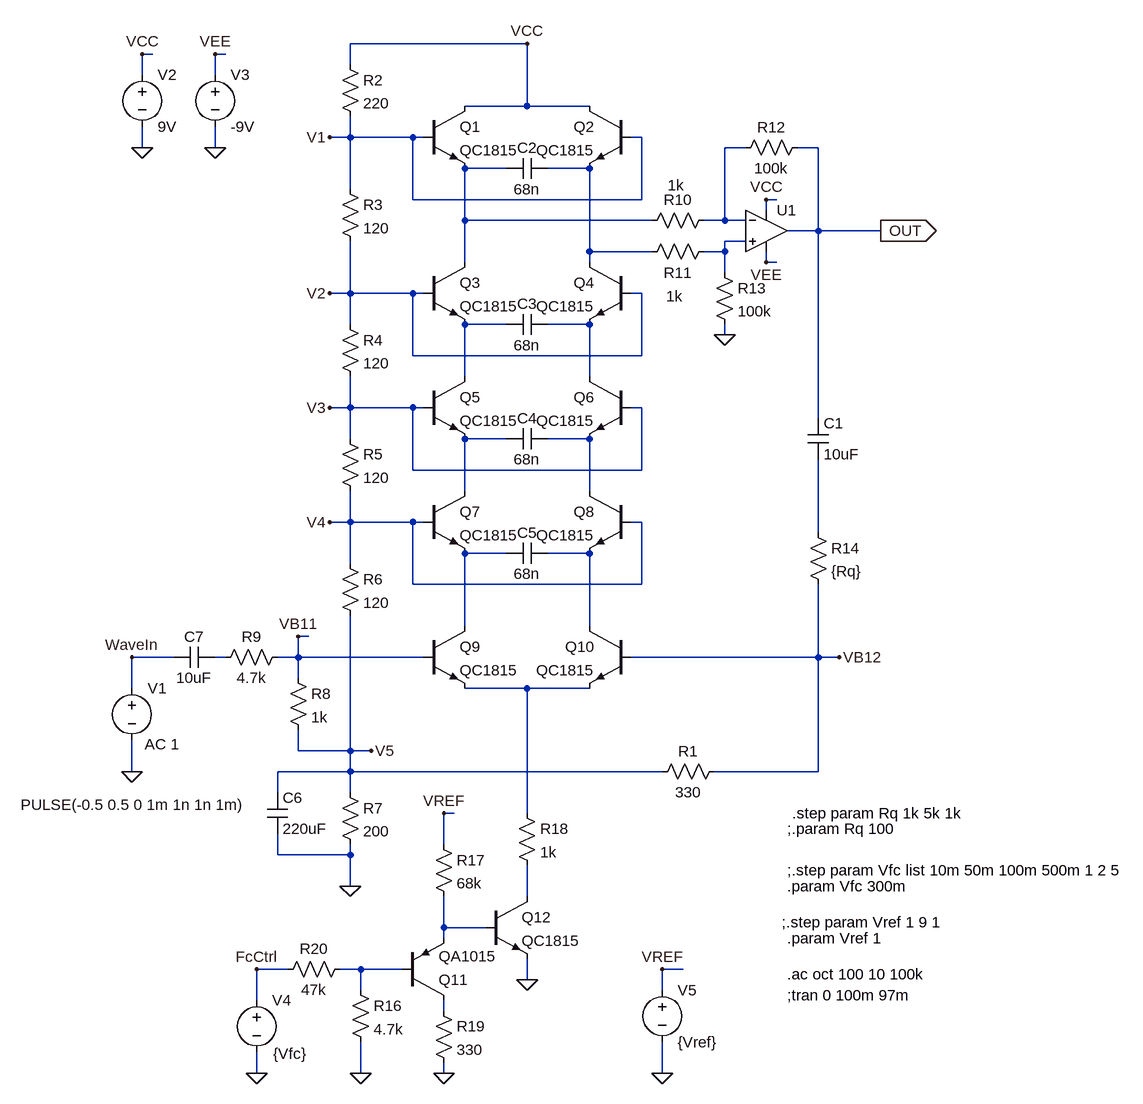
[diagram p0: schematic Analog2_0_Ladder_DiffAmp_CS_AntiLog_R9V_qctrl.asc]
Analog2_0_Ladder_DiffAmp_CS_AntiLog_R9V_qctrl.asc, the LTspice schematic file:
Version 4
SHEET 1 1344 1976
WIRE 240 -32 -32 -32
WIRE -336 -16 -352 -16
WIRE -224 -16 -240 -16
WIRE -32 0 -32 -32
WIRE -352 16 -352 -16
WIRE -240 16 -240 -16
WIRE 240 64 240 -32
WIRE 240 64 144 64
WIRE 336 64 240 64
WIRE -32 112 -32 80
WIRE -32 112 -64 112
WIRE 64 112 -32 112
WIRE 80 112 64 112
WIRE 416 112 400 112
WIRE -352 128 -352 96
WIRE -240 128 -240 96
WIRE 576 128 544 128
WIRE 688 128 656 128
WIRE 208 160 144 160
WIRE 336 160 272 160
WIRE -32 192 -32 112
WIRE 64 208 64 112
WIRE 416 208 416 112
WIRE 416 208 64 208
WIRE 624 208 608 208
WIRE 608 224 608 208
WIRE 144 240 144 160
WIRE 432 240 144 240
WIRE 544 240 544 128
WIRE 544 240 512 240
WIRE 576 240 544 240
WIRE 688 256 688 128
WIRE 688 256 640 256
WIRE 784 256 688 256
WIRE 576 272 544 272
WIRE 336 288 336 160
WIRE 432 288 336 288
WIRE 544 288 544 272
WIRE 544 288 512 288
WIRE 144 304 144 240
WIRE 336 304 336 288
WIRE 608 304 608 288
WIRE 624 304 608 304
WIRE 544 320 544 288
WIRE -32 352 -32 272
WIRE -32 352 -64 352
WIRE 64 352 -32 352
WIRE 80 352 64 352
WIRE 416 352 400 352
WIRE -32 400 -32 352
WIRE 208 400 144 400
WIRE 336 400 272 400
WIRE 544 416 544 400
WIRE 64 448 64 352
WIRE 416 448 416 352
WIRE 416 448 64 448
WIRE 144 480 144 400
WIRE 336 480 336 400
WIRE -32 528 -32 480
WIRE -32 528 -64 528
WIRE 64 528 -32 528
WIRE 80 528 64 528
WIRE 416 528 400 528
WIRE 688 544 688 256
WIRE -32 576 -32 528
WIRE 208 576 144 576
WIRE 336 576 272 576
WIRE 64 624 64 528
WIRE 416 624 416 528
WIRE 416 624 64 624
WIRE 144 656 144 576
WIRE 336 656 336 576
WIRE -32 704 -32 656
WIRE -32 704 -64 704
WIRE 64 704 -32 704
WIRE 80 704 64 704
WIRE 416 704 400 704
WIRE 688 720 688 608
WIRE 208 752 144 752
WIRE 336 752 272 752
WIRE -32 768 -32 704
WIRE 64 800 64 704
WIRE 416 800 416 704
WIRE 416 800 64 800
WIRE 144 864 144 752
WIRE 336 864 336 752
WIRE -96 880 -112 880
WIRE -304 912 -368 912
WIRE -224 912 -240 912
WIRE -112 912 -112 880
WIRE -112 912 -144 912
WIRE 80 912 -112 912
WIRE 688 912 688 800
WIRE 688 912 400 912
WIRE 720 912 688 912
WIRE -112 944 -112 912
WIRE -368 960 -368 912
WIRE 240 960 144 960
WIRE 336 960 240 960
WIRE -112 1056 -112 1024
WIRE -32 1056 -32 848
WIRE -32 1056 -112 1056
WIRE 0 1056 -32 1056
WIRE -368 1088 -368 1040
WIRE -32 1088 -32 1056
WIRE -32 1088 -144 1088
WIRE 448 1088 -32 1088
WIRE 688 1088 688 912
WIRE 688 1088 528 1088
WIRE -144 1120 -144 1088
WIRE -32 1120 -32 1088
WIRE 128 1152 112 1152
WIRE 240 1152 240 960
WIRE 112 1200 112 1152
WIRE -144 1216 -144 1184
WIRE -32 1216 -32 1200
WIRE -32 1216 -144 1216
WIRE -32 1264 -32 1216
WIRE 240 1280 240 1232
WIRE 112 1328 112 1280
WIRE 176 1328 112 1328
WIRE 112 1344 112 1328
WIRE -128 1392 -176 1392
WIRE -16 1392 -48 1392
WIRE 48 1392 -16 1392
WIRE 480 1392 448 1392
WIRE 240 1408 240 1376
WIRE -16 1424 -16 1392
WIRE 448 1424 448 1392
WIRE -176 1440 -176 1392
WIRE 112 1456 112 1440
WIRE -176 1552 -176 1520
WIRE -16 1552 -16 1504
WIRE 112 1552 112 1536
WIRE 448 1552 448 1504
FLAG -352 128 0
FLAG -352 -16 VCC
FLAG -32 1264 0
FLAG 784 256 OUT
IOPIN 784 256 Out
FLAG 240 -32 VCC
FLAG -368 1088 0
FLAG -368 912 WaveIn
FLAG -64 112 V1
FLAG -64 352 V2
FLAG -64 528 V3
FLAG -64 704 V4
FLAG 0 1056 V5
FLAG -112 880 VB11
FLAG 720 912 VB12
FLAG 608 208 VCC
FLAG 608 304 VEE
FLAG 544 416 0
FLAG -240 128 0
FLAG -240 -16 VEE
FLAG -176 1552 0
FLAG -16 1552 0
FLAG 240 1408 0
FLAG 112 1152 VREF
FLAG 112 1552 0
FLAG 448 1552 0
FLAG 448 1392 VREF
FLAG -176 1392 FcCtrl
SYMBOL npn 80 64 R0
SYMATTR InstName Q1
SYMATTR Value QC1815
SYMBOL npn 400 64 M0
SYMATTR InstName Q2
SYMATTR Value QC1815
SYMBOL npn 80 304 R0
SYMATTR InstName Q3
SYMATTR Value QC1815
SYMBOL npn 400 304 M0
SYMATTR InstName Q4
SYMATTR Value QC1815
SYMBOL npn 80 480 R0
SYMATTR InstName Q5
SYMATTR Value QC1815
SYMBOL npn 400 480 M0
SYMATTR InstName Q6
SYMATTR Value QC1815
SYMBOL npn 80 656 R0
SYMATTR InstName Q7
SYMATTR Value QC1815
SYMBOL npn 400 656 M0
SYMATTR InstName Q8
SYMATTR Value QC1815
SYMBOL cap 272 384 R90
WINDOW 0 0 32 VBottom 2
WINDOW 3 32 32 VTop 2
SYMATTR InstName C3
SYMATTR Value 68n
SYMBOL cap 272 560 R90
WINDOW 0 0 32 VBottom 2
WINDOW 3 32 32 VTop 2
SYMATTR InstName C4
SYMATTR Value 68n
SYMBOL cap 272 736 R90
WINDOW 0 0 32 VBottom 2
WINDOW 3 32 32 VTop 2
SYMATTR InstName C5
SYMATTR Value 68n
SYMBOL npn 80 864 R0
SYMATTR InstName Q9
SYMATTR Value QC1815
SYMBOL npn 400 864 M0
SYMATTR InstName Q10
SYMATTR Value QC1815
SYMBOL voltage -368 944 R0
WINDOW 123 20 102 Left 2
WINDOW 39 0 0 Left 2
WINDOW 3 -171 195 Left 2
SYMATTR Value2 AC 1
SYMATTR Value PULSE(-0.5 0.5 0 1m 1n 1n 1m)
SYMATTR InstName V1
SYMBOL voltage -352 0 R0
WINDOW 123 0 0 Left 2
WINDOW 39 0 0 Left 2
SYMATTR InstName V2
SYMATTR Value 9V
SYMBOL res 544 1072 R90
WINDOW 0 0 56 VBottom 2
WINDOW 3 32 56 VTop 2
SYMATTR InstName R1
SYMATTR Value 330
SYMBOL cap 672 544 R0
SYMATTR InstName C1
SYMATTR Value 10uF
SYMBOL cap 272 144 R90
WINDOW 0 0 32 VBottom 2
WINDOW 3 32 32 VTop 2
SYMATTR InstName C2
SYMATTR Value 68n
SYMBOL res -48 -16 R0
SYMATTR InstName R2
SYMATTR Value 220
SYMBOL res -48 176 R0
SYMATTR InstName R3
SYMATTR Value 120
SYMBOL res -48 384 R0
SYMATTR InstName R4
SYMATTR Value 120
SYMBOL res -48 560 R0
SYMATTR InstName R5
SYMATTR Value 120
SYMBOL res -48 752 R0
SYMATTR InstName R6
SYMATTR Value 120
SYMBOL res -48 1104 R0
SYMATTR InstName R7
SYMATTR Value 200
SYMBOL res -128 928 R0
SYMATTR InstName R8
SYMATTR Value 1k
SYMBOL res -128 896 R90
WINDOW 0 0 56 VBottom 2
WINDOW 3 32 56 VTop 2
SYMATTR InstName R9
SYMATTR Value 4.7k
SYMBOL cap -160 1120 R0
SYMATTR InstName C6
SYMATTR Value 220uF
SYMBOL cap -240 896 R90
WINDOW 0 0 32 VBottom 2
WINDOW 3 32 32 VTop 2
SYMATTR InstName C7
SYMATTR Value 10uF
SYMBOL Opamps\\UniversalOpamp2 608 256 R0
SYMATTR InstName U1
SYMBOL res 528 224 R90
WINDOW 0 0 56 VBottom 2
WINDOW 3 -54 59 VTop 2
SYMATTR InstName R10
SYMATTR Value 1k
SYMBOL res 528 272 R90
WINDOW 0 64 56 VBottom 2
WINDOW 3 69 61 VTop 2
SYMATTR InstName R11
SYMATTR Value 1k
SYMBOL res 672 112 R90
WINDOW 0 0 56 VBottom 2
WINDOW 3 32 56 VTop 2
SYMATTR InstName R12
SYMATTR Value 100k
SYMBOL res 528 304 R0
SYMATTR InstName R13
SYMATTR Value 100k
SYMBOL voltage -240 0 R0
WINDOW 123 0 0 Left 2
WINDOW 39 0 0 Left 2
SYMATTR InstName V3
SYMATTR Value -9V
SYMBOL res 672 704 R0
SYMATTR InstName R14
SYMATTR Value {Rq}
SYMBOL voltage -176 1424 R0
WINDOW 3 25 98 Left 2
WINDOW 123 0 0 Left 2
WINDOW 39 0 0 Left 2
SYMATTR Value {Vfc}
SYMATTR InstName V4
SYMBOL pnp 48 1440 M180
SYMATTR InstName Q11
SYMATTR Value QA1015
SYMBOL res -32 1408 R0
SYMATTR InstName R16
SYMATTR Value 4.7k
SYMBOL res 96 1184 R0
SYMATTR InstName R17
SYMATTR Value 68k
SYMBOL npn 176 1280 R0
SYMATTR InstName Q12
SYMATTR Value QC1815
SYMBOL res 224 1136 R0
SYMATTR InstName R18
SYMATTR Value 1k
SYMBOL res 96 1440 R0
SYMATTR InstName R19
SYMATTR Value 330
SYMBOL res -32 1376 R90
WINDOW 0 0 56 VBottom 2
WINDOW 3 32 56 VTop 2
SYMATTR InstName R20
SYMATTR Value 47k
SYMBOL voltage 448 1408 R0
WINDOW 123 0 0 Left 2
WINDOW 39 0 0 Left 2
SYMATTR InstName V5
SYMATTR Value {Vref}
TEXT 640 1400 Left 2 !.ac oct 100 10 100k
TEXT 640 1432 Left 2 !;tran 0 100m 97m
TEXT 640 1240 Left 2 !;.step param Vfc list 10m 50m 100m 500m 1 2 5
TEXT 640 1176 Left 2 !;.param Rq 100
TEXT 640 1264 Left 2 !.param Vfc 300m
TEXT 632 1320 Left 2 !;.step param Vref 1 9 1
TEXT 640 1344 Left 2 !.param Vref 1
TEXT 648 1152 Left 2 !.step param Rq 1k 5k 1k

The netlist it stands for:
* Analog2_0_Ladder_DiffAmp_CS_AntiLog_R9V_qctrl.asc
Q1 VCC V1 N002 0 QC1815
Q2 VCC V1 N003 0 QC1815
Q3 N002 V2 N005 0 QC1815
Q4 N003 V2 N006 0 QC1815
Q5 N005 V3 N007 0 QC1815
Q6 N006 V3 N008 0 QC1815
Q7 N007 V4 N010 0 QC1815
Q8 N008 V4 N011 0 QC1815
C3 N006 N005 68n
C4 N008 N007 68n
C5 N011 N010 68n
Q9 N010 VB11 N013 0 QC1815
Q10 N011 VB12 N013 0 QC1815
V1 WaveIn 0 PULSE(-0.5 0.5 0 1m 1n 1n 1m) AC 1
V2 VCC 0 9V
R1 VB12 V5 330
C1 OUT N009 10uF
C2 N003 N002 68n
R2 VCC V1 220
R3 V1 V2 120
R4 V2 V3 120
R5 V3 V4 120
R6 V4 V5 120
R7 V5 0 200
R8 VB11 V5 1k
R9 VB11 N012 4.7k
C6 V5 0 220uF
C7 N012 WaveIn 10uF
XU1 N004 N001 VCC VEE OUT level.2 Avol=1Meg GBW=10Meg Slew=10Meg ilimit=25m rail=0 Vos=0 phimargin=45 en=0 enk=0 in=0 ink=0 Rin=500Meg  ; pins IN+ IN- V+ V- OUT
R10 N001 N002 1k
R11 N004 N003 1k
R12 OUT N001 100k
R13 N004 0 100k
V3 VEE 0 -9V
R14 N009 VB12 {Rq}
V4 FcCtrl 0 {Vfc}
Q11 N017 N016 N015 0 QA1015
R16 N016 0 4.7k
R17 VREF N015 68k
Q12 N014 N015 0 0 QC1815
R18 N013 N014 1k
R19 N017 0 330
R20 N016 FcCtrl 47k
V5 VREF 0 {Vref}
.model NPN NPN
.model PNP PNP
.lib standard.bjt
.ac oct 100 10 100k
;tran 0 100m 97m
;.step param Vfc list 10m 50m 100m 500m 1 2 5
;.param Rq 100
.param Vfc 300m
;.step param Vref 1 9 1
.param Vref 1
.step param Rq 1k 5k 1k
.lib UniversalOpamps2.sub
.backanno
.end